# Altium project otis_v1.PrjPCB
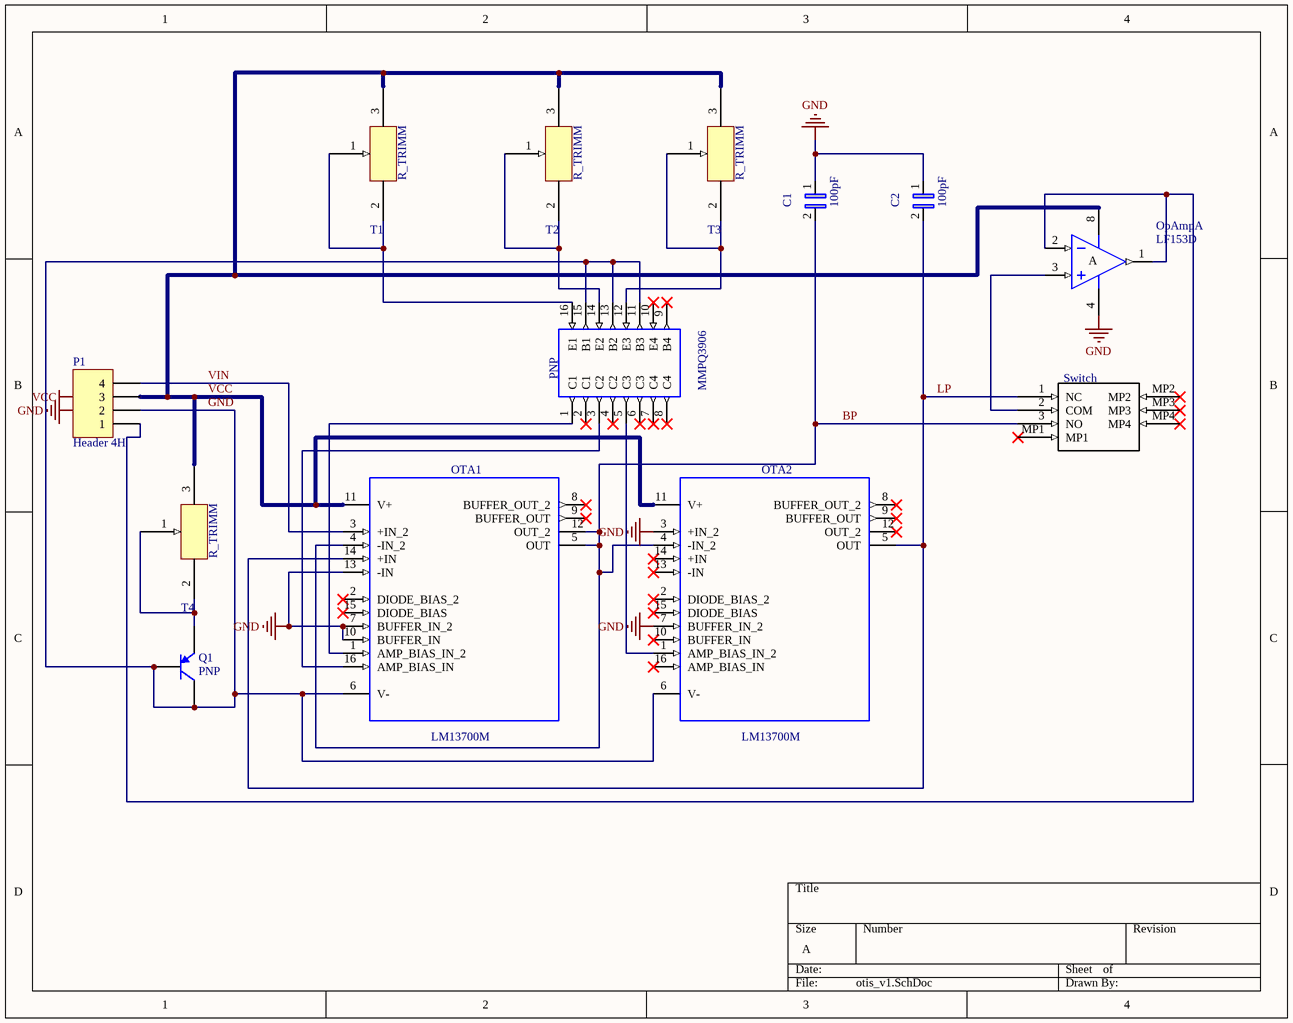
[diagram p0: otis_v1.SchDoc]
2 sheets, 29 parts. Net scope: global (net labels, ports and power ports of the same name join across sheets).
Board file: otis_v1.PcbDoc
Sheets:
  otis_v1.SchDoc
  Sheet1.SchDoc

## Sheet otis_v1.SchDoc
size A

### Parts
(Parts that share a designator on the sheet are numbered #1, #2 ... from top to bottom, then left to right.)
C1#1  100pF  [_C*CAPC1005X55N_CC0402C100K5GACAUTO_CPrimary_C]
C2#1  100pF  [_C*CAPC1005X55N_CC0402C100K5GACAUTO_CPrimary_C]
OpAmp#1  LF153D  [SO8_N]  (part A of 2)
OTA1#1  LM13700M  [LM13700LM13700MLM13700LM13700MLM13700PrimaryLM13700]
OTA2#1  LM13700M  [LM13700LM13700MLM13700LM13700MLM13700PrimaryLM13700]
P1#1  Header 4H  [HDR1X4H]
PNP  MMPQ3906  [LM13700LM13700MLM13700LM13700MLM13700PrimaryLM13700]
Q1#1  PNP  [SOT-23B_N]
Switch#1  (no value)  [PCBComponent_1]
T1#1  (no value)  [PCBComponent_1]
T2#1  (no value)  [PCBComponent_1]
T3#1  (no value)  [PCBComponent_1]
T4#1  (no value)  [PCBComponent_1]

### Nets
GND: C1#1.1 C2#1.1 OpAmp#1.4(V-) OTA1#1.6(V-) OTA1#1.7(BUFFER_IN_2) OTA1#1.10(BUFFER_IN) OTA1#1.13(-IN) OTA2#1.3(+IN_2) OTA2#1.6(V-) OTA2#1.7(BUFFER_IN_2) P1#1.2 PNP.11(B3) PNP.13(B2) PNP.15(B1) Q1#1.1(C) Q1#1.2(B)
VCC: OpAmp#1.8(V+) OTA1#1.11(V+) OTA2#1.11(V+) P1#1.3 T1#1.3 T2#1.3 T3#1.3 T4#1.3
BP: C1#1.2 OTA1#1.4(-IN_2) OTA1#1.5(OUT) OTA1#1.12(OUT_2) OTA2#1.4(-IN_2) Switch#1.3(NO)
LP: C2#1.2 OTA1#1.14(+IN) OTA2#1.5(OUT) Switch#1.1(NC)
VIN: OTA1#1.3(+IN_2) P1#1.4
NetOpAmp#1_1: OpAmp#1.1(OUT) OpAmp#1.2(IN-) P1#1.1
NetOpAmp#1_3: OpAmp#1.3(IN+) Switch#1.2(COM)
NetOTA1#1_1: OTA1#1.1(AMP_BIAS_IN_2) PNP.1(C1)
NetOTA1#1_16: OTA1#1.16(AMP_BIAS_IN) PNP.3(C2)
NetOTA2#1_1: OTA2#1.1(AMP_BIAS_IN_2) PNP.5(C3)
NetPNP_12: PNP.12(E3) T3#1.1
NetPNP_14: PNP.14(E2) T2#1.1
NetPNP_16: PNP.16(E1) T1#1.1
NetQ1#1_3: Q1#1.3(E) T4#1.1

Not connected (* = marked no-connect by the designer): OTA1#1 2(DIODE_BIAS_2)* 8(BUFFER_OUT_2)* 9(BUFFER_OUT)* 15(DIODE_BIAS)*; OTA2#1 2(DIODE_BIAS_2)* 8(BUFFER_OUT_2)* 9(BUFFER_OUT)* 10(BUFFER_IN)* 12(OUT_2)* 13(-IN)* 14(+IN)* 15(DIODE_BIAS)* 16(AMP_BIAS_IN)*; PNP 2(C1)* 4(C2)* 6(C3)* 7(C4)* 8(C4)* 9(B4)* 10(E4)*; Switch#1 MP1* MP2* MP3* MP4*; T1#1 2; T2#1 2; T3#1 2; T4#1 2

### Notes on the sheet
- Labels drawn without touching a wire or pin: GND, VCC
- (in symbol Component_1) R_TRIMM
- (in symbol LF153D, part A) A

### Library data of the parts
C1#1 C2#1 = C0402C100K5GACAUTO: CAPACITOR CERAMIC 10 PF 10% TOL 50V C0G 0402; MF: KEMET; SnapEDA_Link: https://www.snapeda.com/parts/C0402C100K5GACAUTO/KEMET/view-part/?ref=snap; Availability: Unavailable; MP: C0402C100K5GACAUTO; Package: 0402 KEMET; Price: None; Value: *
OpAmp#1 = LF153D: Wide-Bandwidth Dual J-FET Operational Amplifier; Published: 24-Aug-2001; LatestRevisionDate: 13-Apr-2006; LatestRevisionNote: IPC-7351 Footprint Added.; DatasheetVersion: Jun-1998; PackageVersion: Dec-2002; PackageReference: SO8; Publisher: Altium Limited; PackageDescription: 8-Pin Small Outline Integrated Circuit 1.27 mm Pitch; Code_JEDEC: MS-012-AA; Code_IPC: SOIC127P600-8; ComponentLink1Description: Manufacturer Link; ComponentLink1URL: http://www.st.com/; ComponentLink2Description: Datasheet; ComponentLink2URL: http://www.st.com/stonline/products/literature/ds/2153/lf353.pdf
OTA1#1 OTA2#1 PNP = LM13700M: Dual Operational Transconductance Amplifier with Linearizing Diodes and Buffers 16-SOIC 0 to 70; MF: Texas Instruments; Price: None; Availability: Unavailable; MP: LM13700M; Package: SOIC-16 Texas Instruments; SnapEDA_Link: https://www.snapeda.com/parts/LM13700M/Texas%20Instruments/view-part/?ref=snap; Value: *
P1#1 = Header 4H: Header, 4-Pin, Right Angle; LatestRevisionDate: 17-Jul-2002; LatestRevisionNote: Re-released for DXP Platform.; Publisher: Altium Limited
Q1#1 = PNP: PNP Bipolar Transistor; Published: 8-Jun-2000; LatestRevisionDate: 29-May-2009; LatestRevisionNote: IPC-7351 Footprint Added.; PackageVersion: Aug-1999; PackageReference: SOT-23B; Publisher: Altium Limited; PackageDescription: 3-Pin SOT-23 Package 0.95 mm Pitch, 2.4 mm Lead Span
Switch#1 T1#1 T2#1 T3#1 T4#1 = Component_1

## Sheet Sheet1.SchDoc
size A
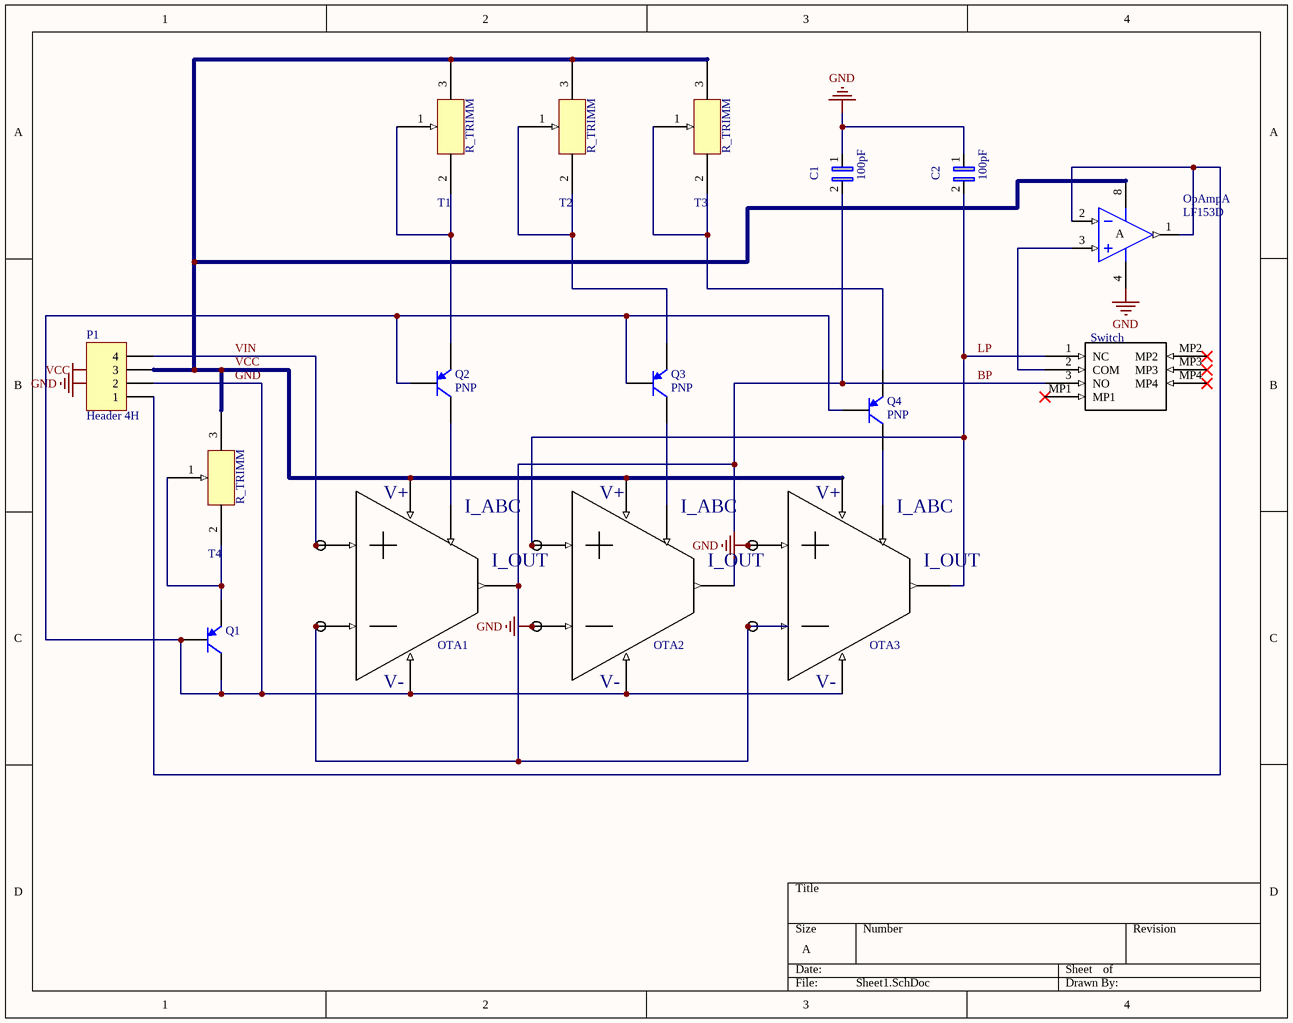
[diagram p1: Sheet1.SchDoc]

### Parts
(Parts that share a designator on the sheet are numbered #1, #2 ... from top to bottom, then left to right.)
C1#2  100pF  [_C*CAPC1005X55N_CC0402C100K5GACAUTO_CPrimary_C]
C2#2  100pF  [_C*CAPC1005X55N_CC0402C100K5GACAUTO_CPrimary_C]
OpAmp#2  LF153D  [SO8_N]  (part A of 2)
OTA1#2  (no value)
OTA2#2  (no value)
OTA3  (no value)
P1#2  Header 4H  [HDR1X4H]
Q1#2  (no value)  [TO-92A]
Q2  PNP  [SOT-23B]
Q3  PNP  [SOT-23B]
Q4  PNP  [SOT-23B]
Switch#2  (no value)  [PCBComponent_1]
T1#2  (no value)  [PCBComponent_1]
T2#2  (no value)  [PCBComponent_1]
T3#2  (no value)  [PCBComponent_1]
T4#2  (no value)  [PCBComponent_1]

### Nets
GND: C1#2.1 C2#2.1 OpAmp#2.4(V-) OTA1#2.?5 OTA2#2.?2 OTA2#2.?5 OTA3.?1 OTA3.?5 P1#2.2 Q1#2.2(B) Q1#2.3(C) Q2.2(B) Q3.2(B) Q4.2(B)
VCC: OpAmp#2.8(V+) OTA1#2.?4 OTA2#2.?4 OTA3.?4 P1#2.3 T1#2.3 T2#2.3 T3#2.3 T4#2.3
BP: C1#2.2 OTA1#2.?2 OTA1#2.?3 OTA2#2.?3 OTA3.?2 Switch#2.3(NO)
LP: C2#2.2 OTA2#2.?1 OTA3.?3 Switch#2.1(NC)
VIN: OTA1#2.?1 P1#2.4
NetOpAmp#2_1: OpAmp#2.1(OUT) OpAmp#2.2(IN-) P1#2.1
NetOpAmp#2_3: OpAmp#2.3(IN+) Switch#2.2(COM)
NetOTA1#2_?6: OTA1#2.?6 Q2.1(C)
NetOTA2#2_?6: OTA2#2.?6 Q3.1(C)
NetOTA3_?6: OTA3.?6 Q4.1(C)
NetQ1#2_1: Q1#2.1(E) T4#2.1
NetQ2_3: Q2.3(E) T1#2.1
NetQ3_3: Q3.3(E) T2#2.1
NetQ4_3: Q4.3(E) T3#2.1

Not connected (* = marked no-connect by the designer): Switch#2 MP1* MP2* MP3* MP4*; T1#2 2; T2#2 2; T3#2 2; T4#2 2

### Notes on the sheet
- Labels drawn without touching a wire or pin: GND, VCC
- (in symbol Component_1) R_TRIMM; V+; I_ABC; I_OUT; V-
- (in symbol LF153D, part A) A

### Library data of the parts
C1#2 C2#2 = C0402C100K5GACAUTO: as C1#1 on sheet otis_v1; SnapEDA_Link: https://www.snapeda.com/parts/C0402C100K5GACAUTO/KEMET/view-part/?ref=snap; Availability: Unavailable; MP: C0402C100K5GACAUTO; Package: 0402 KEMET; Price: None; Value: *
OpAmp#2 = LF153D: as OpAmp#1 on sheet otis_v1; Published: 24-Aug-2001; LatestRevisionDate: 13-Apr-2006; LatestRevisionNote: IPC-7351 Footprint Added.; DatasheetVersion: Jun-1998; PackageVersion: Dec-2002; PackageReference: SO8; Publisher: Altium Limited; PackageDescription: 8-Pin Small Outline Integrated Circuit 1.27 mm Pitch; Code_JEDEC: MS-012-AA; Code_IPC: SOIC127P600-8; ComponentLink1Description: Manufacturer Link; ComponentLink1URL: http://www.st.com/; ComponentLink2Description: Datasheet; ComponentLink2URL: http://www.st.com/stonline/products/literature/ds/2153/lf353.pdf
OTA1#2 OTA2#2 OTA3 Switch#2 T1#2 T2#2 T3#2 T4#2 = Component_1
P1#2 = Header 4H: Header, 4-Pin, Right Angle; LatestRevisionDate: 17-Jul-2002; LatestRevisionNote: Re-released for DXP Platform.; Publisher: Altium Limited
Q1#2 = 2N3906: PNP General Purpose Amplifier; Published: 8-Jun-2000; LatestRevisionDate: 15-Jan-2003; LatestRevisionNote: PCB Footprint 'BCY-W3/D4.7' replaced; DatasheetDocument: 1997; PackageDocument: Sep-1998; PackageReference: TO-92A; Publisher: Altium Limited; Code_JEDEC: TO-92A; ComponentLink1Description: Manufacturer Link; ComponentLink1URL: http://www.fairchildsemi.com/; ComponentLink2Description: Datasheet; ComponentLink2URL: http://www.fairchildsemi.com/ds/2N%2F2N3906.pdf
Q2-Q4 = PNP: PNP Bipolar Transistor; Published: 8-Jun-2000; LatestRevisionDate: 17-Jul-2002; LatestRevisionNote: Re-released for DXP Platform.; PackageReference: SOT-23B; Publisher: Altium Limited; Code_JEDEC: SOT-23

## Nets that join several sheets
GND: otis_v1 (16 pins), Sheet1 (14 pins)
VCC: otis_v1 (8 pins), Sheet1 (9 pins)
BP: otis_v1 (6 pins), Sheet1 (6 pins)
LP: otis_v1 (C2#1.2 OTA1#1.14 OTA2#1.5 Switch#1.1), Sheet1 (C2#2.2 OTA2#2.?1 OTA3.?3 Switch#2.1)
VIN: otis_v1 (OTA1#1.3 P1#1.4), Sheet1 (OTA1#2.?1 P1#2.4)